# Altium schematic sheet FRAM_memory.SchDoc
size A4; Organization: Creotech Instruments; Address1: Gen. L. Okulickiego 7/9; Address2: 05-500 Piaseczno; Address3: Poland
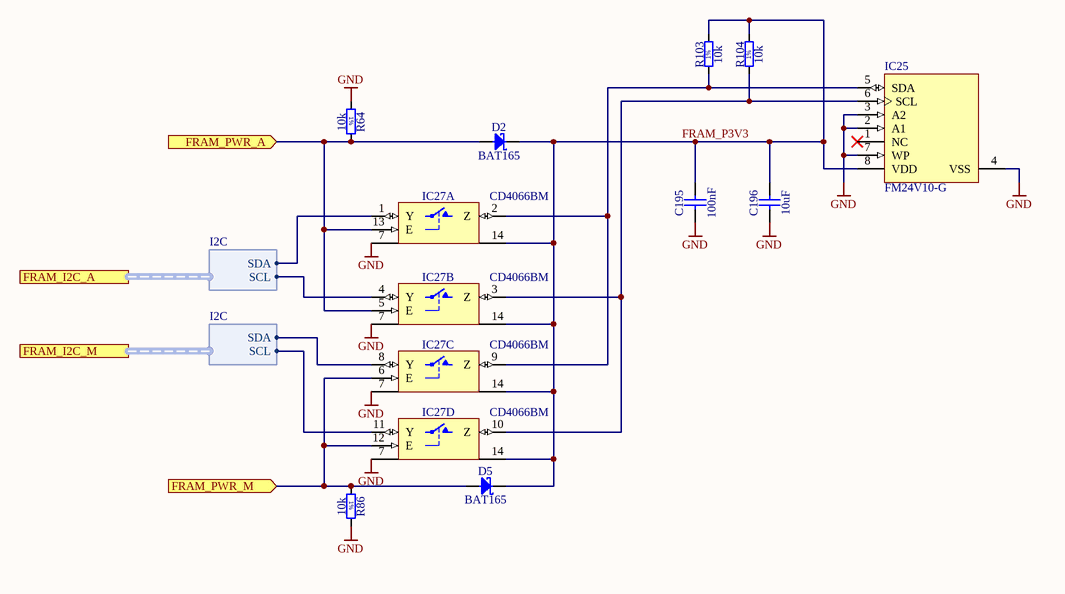
[diagram p0: FRAM_memory.SchDoc]

## Parts
C195  100nF  [CAPC1005X55N]
C196  10uF  [CAPC1608X80N]
D2  BAT165  [SOD2512X110N]
D5  BAT165  [SOD2512X110N]
IC25  FM24V10-G  [SOIC127P600X175-8N]
IC27  CD4066BM  [SOIC127P600X175-14N]  (parts A,B,C,D of 4)
R64  10k  [RESC1005X40N]
R86  10k  [RESC1005X40N]
R103  10k  [RESC1005X40N]
R104  10k  [RESC1005X40N]

## Ports
FRAM_I2C_A (harness I2C), FRAM_I2C_M (harness I2C), FRAM_PWR_A (in), FRAM_PWR_M (in)

## Harnesses
I2C: SDA, SCL

## Nets
FRAM_P3V3: C195.2 C196.2 D2.1(C) D5.1(C) IC25.8(VDD) IC27.14(VDD) R103.2 R104.2  [also labelled VDD]
GND: C195.1 C196.1 IC25.2(A1) IC25.3(A2) IC25.4(VSS) IC25.7(WP) IC27.7(VSS) R64.1 R86.2
FRAM_PWR_A: D2.2(A) IC27.5(E) IC27.13(E) R64.2 ; port FRAM_PWR_A
FRAM_PWR_M: D5.2(A) IC27.6(E) IC27.12(E) R86.1 ; port FRAM_PWR_M
NetIC25_5: IC25.5(SDA) IC27.2(Z) IC27.9(Z) R103.1
NetIC25_6: IC25.6(SCL) IC27.3(Z) IC27.10(Z) R104.1
NetIC27_1: IC27.1(Y) ; port FRAM_I2C_A.SDA
NetIC27_4: IC27.4(Y) ; port FRAM_I2C_A.SCL
NetIC27_8: IC27.8(Y) ; port FRAM_I2C_M.SDA
NetIC27_11: IC27.11(Y) ; port FRAM_I2C_M.SCL

Not connected (* = marked no-connect by the designer): IC25 1(NC)*

## Notes on the sheet
- Title
- Size:
- Date:
- A4
- Number:
- Time:
- Revision:
- Sheet
- of
- File:
- (in symbol R0402_10K_1%_0.0625W_100PPM) 1%

## Library data of the parts
C195 = CC0402_100NF_25V_10%_X7R_YUDEN_TMK105B7104KVHF: Non-polarised capacitor; Part Description: SMD Multilayer Chip Ceramic Capacitor (High Dielectric Type) for Automotive / Industrial Applications; Manufacturer: TAIYO YUDEN; Voltage: 25V; TC: X7R; Tolerance: ±10%; Part Number: CC0402_100NF_25V_10%_X7R_YUDEN_TMK105B7104KVHF; Component Kind: Standard; Component Type: Standard; Pin Count: 2; Value: 100nF; Status: Not Recommended; Manufacturer Part Number: TMK105B7104KVHF; Case: 0402; Mounted: Yes; Socket: No; SMD: Yes; Sense: No; HelpURL: \\cern.ch\dfs\Applications\Altium\Datasheets\CC0402_TAIYO-YUDEN_TMK105B7104KVHF.pdf; Author: CERN DEM JLC; CreateDate: 10/05/2017; LatestRevisionDate: 10/05/2017; ComponentHeight: 0.55mm
C196 = CC0603_10UF_16V_20%_X5R: Non-polarised capacitor; Part Description: SMD Multilayer Chip Ceramic Capacitor; Manufacturer: GENERIC; Manufacturer1 Part Number: GRM188R61C106MA73D; Voltage: 16V; TC: X5R; Tolerance: ±20%; Part Number: CC0603_10UF_16V_20%_X5R; Component Kind: Standard; Component Type: Standard; Pin Count: 2; Value: 10uF; Status: None; Manufacturer Part Number: CC0603_10UF_16V_20%_X5R; Case: 0603; Mounted: Yes; Socket: No; SMD: Yes; Sense: No; Manufacturer1 Example: MURATA; Manufacturer1 ComponentHeight: 0.8mm; HelpURL: \\cern.ch\dfs\Applications\Altium\Datasheets\CC0603_X5R_MURATA_GRM.pdf; Author: CERN DEM MR; CreateDate: 02.03.2016; LatestRevisionDate: 02.03.2016
D2 D5 = BAT165: Schottky Diode; Part Description: Medium Power AF Schottky Diode; Manufacturer: INFINEON; Voltage: 40V; Power: 750mA; PressFit: No; Bonding: No; Part Number: BAT165; Component Kind: Standard; Component Type: Standard; Device: BAT165; PackageDescription: Small Outline Diode Flat Lead (SOD-323), 1.70mm W X 1.25mm L X 1.10mm H body,  IPC Medium Density; Manufacturer Part Number: BAT165; Pin Count: 2; Case: SOD323; Mounted: Yes; Socket: No; SMD: Yes; Sense: No; ComponentHeight: 1.1mm; HelpURL: \\cern.ch\dfs\Applications\Altium\Datasheets\BAT165.pdf; Author: CERN DEM JLC; CreateDate: 2014-11-12; LatestRevisionDate: 2014-11-12
IC25 = MEM_FM24V10-G: Manufacturer: Cypress; Part Description: 1Mbit I2C FRAM; Bonding: No; PressFit: No; Case: *; Component Kind: Standard; Component Type: Standard; ComponentHeigth: *; CreateDate: 2018-01-01; Device: FM24V10-G; Footprint: *; HelpURL: *; LatestRevisionDate: 2018-01-01; Manufacturer Part Number: FM24V10-G; Mounted: Yes; PackageDescription: SO8; Part Number: FM24V10-G; Pin Count: 8; Sense: No; SMD: Yes; Socket: No; Value: *
IC27 = CD4066BM: Part Description: CMOS Quad Bilateral Switch; Manufacturer: TEXAS INSTRUMENTS; PressFit: No; Bonding: No; Part Number: CD4066BM; Component Kind: Standard; Component Type: Standard; Device: CD4066BM; PackageDescription: SOIC 14, Pitch 1.27mm - Body 4x8.75mm, IPC Medium Density; Manufacturer Part Number: CD4066BM; Pin Count: 14; Case: SOIC14; Mounted: Yes; Socket: No; SMD: Yes; Sense: No; ComponentHeight: 1.75mm; Author: CERN DEM MR; HelpURL: \\cern.ch\dfs\Applications\Altium\Datasheets\CD4066BM.pdf; CreateDate: 2016-01-21; LatestRevisionDate: 2016-01-21
R64 R86 R103 R104 = R0402_10K_1%_0.0625W_100PPM: Resistor - 1%; Part Description: General Purpose Thick Film Chip Resistor; Manufacturer: GENERIC; Manufacturer1 Part Number: 232270671003L; TC: ±100ppm/°C; PressFit: No; Part Number: R0402_10K_1%_0.0625W_100PPM; Component Kind: Standard; Component Type: Standard; Pin Count: 2; Value: 10k; Status: Not Recommended; Power: 0.0625W; Tolerance: ±1%; Manufacturer Part Number: R0402_10K_1%_0.0625W_100PPM; Case: 0402; Mounted: Yes; Sense: No; Socket: No; SMD: Yes; Manufacturer1 Example: YAGEO PHYCOMP; Manufacturer1 ComponentHeight: 0.4mm; HelpURL: \\cern.ch\dfs\Applications\Altium\Datasheets\R0402_Phycomp_RC0402.pdf; Author: CERN DEM JLC; CreateDate: 03/12/2007; LatestRevisionDate: 17/10/2012